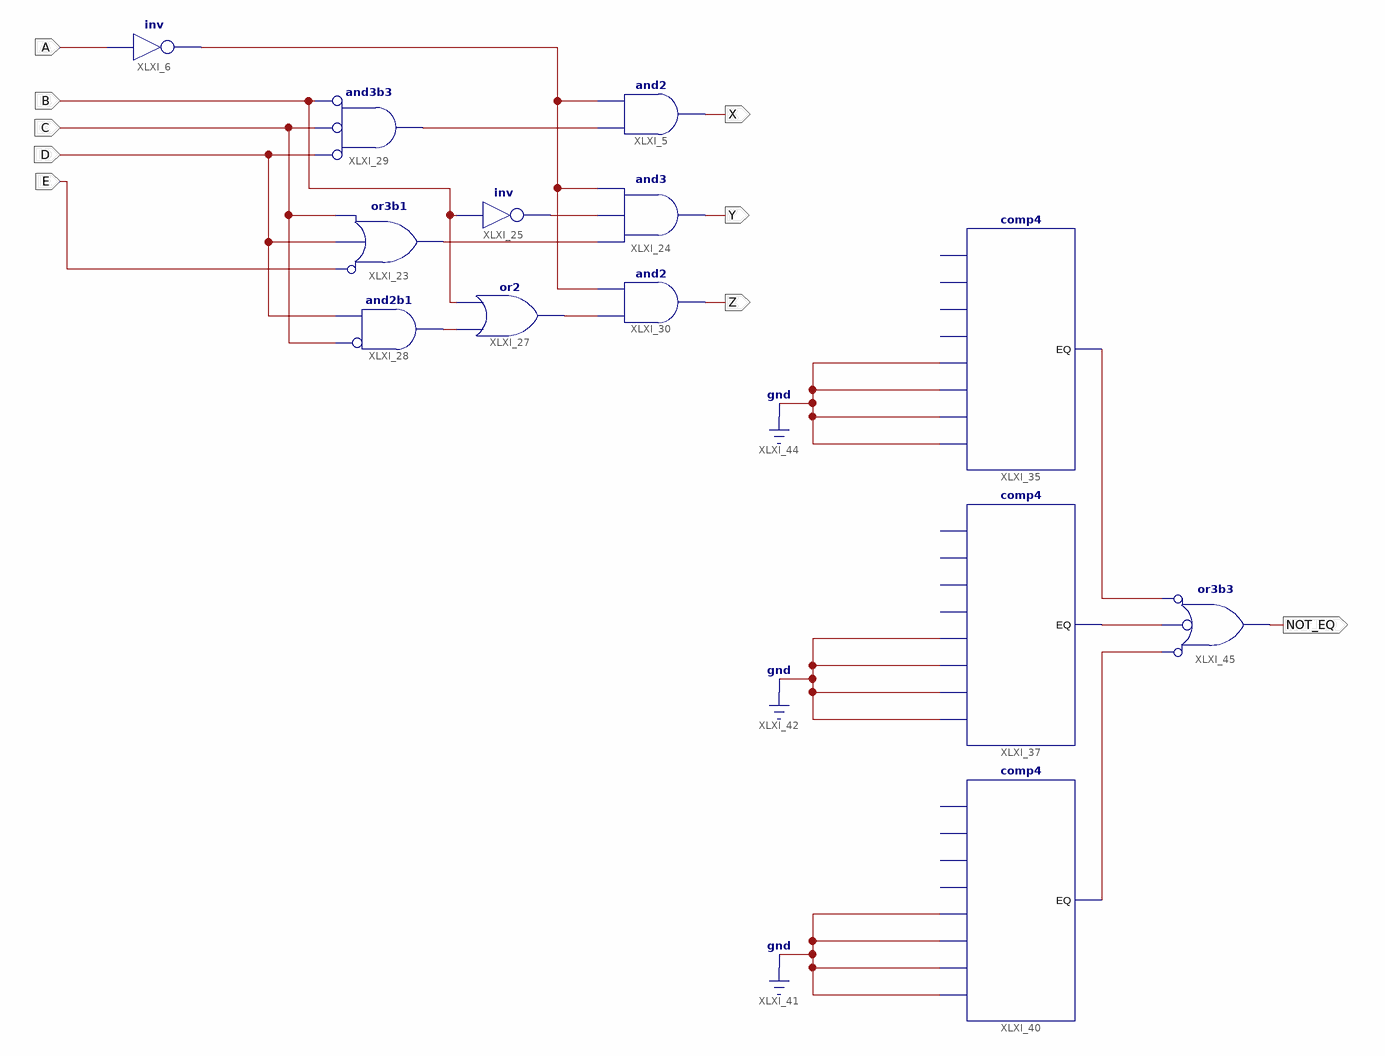
[diagram p0: schematic sheet 1]
// Xilinx ISE schematic joe_breakdown_2.sch (spartan6) as structural Verilog: 13 symbols, 9 ports
module joe_breakdown_2 (
  input  A,
  input  E,
  input  D,
  input  C,
  input  B,
  output X,
  output Y,
  output Z,
  output NOT_EQ
);

  wire XLXN_17, XLXN_18, XLXN_58, XLXN_62, XLXN_73, XLXN_83, XLXN_96, XLXN_97, XLXN_98;

  and XLXI_5 (X, XLXN_18, XLXN_17);
  not XLXI_6 (XLXN_17, A);
  and XLXI_24 (Y, XLXN_58, XLXN_62, XLXN_17);
  not XLXI_25 (XLXN_62, B);
  or XLXI_27 (XLXN_83, XLXN_73, B);
  or XLXI_23 (XLXN_58, ~E, D, C);  // or3b1
  and XLXI_28 (XLXN_73, ~C, D);  // and2b1
  and XLXI_29 (XLXN_18, ~D, ~C, ~B);  // and3b3
  and XLXI_30 (Z, XLXN_83, XLXN_17);
  comp4 XLXI_35 (.B0(1'b0), .B1(1'b0), .B2(1'b0), .B3(1'b0), .EQ(XLXN_97));  // open: A0, A1, A2, A3
  comp4 XLXI_37 (.B0(1'b0), .B1(1'b0), .B2(1'b0), .B3(1'b0), .EQ(XLXN_98));  // open: A0, A1, A2, A3
  comp4 XLXI_40 (.B0(1'b0), .B1(1'b0), .B2(1'b0), .B3(1'b0), .EQ(XLXN_96));  // open: A0, A1, A2, A3
  or XLXI_45 (NOT_EQ, ~XLXN_96, ~XLXN_98, ~XLXN_97);  // or3b3
endmodule
